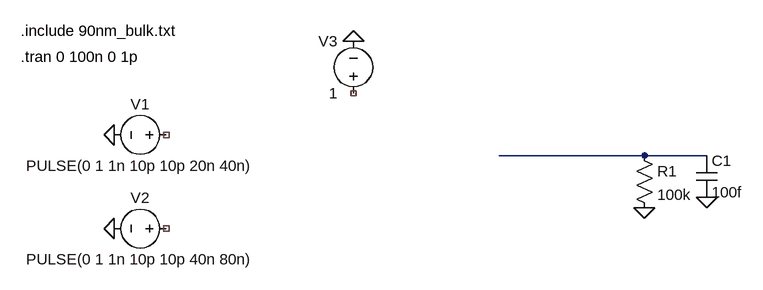
[diagram p0: schematic testingformat.asc]
testingformat.asc, the LTspice schematic file:
Version 4
SHEET 1 960 680
WIRE 800 192 576 192
WIRE 896 192 800 192
FLAG -16 160 0
FLAG -16 304 0
FLAG 352 16 0
FLAG 800 272 0
FLAG 896 256 0
SYMBOL voltage 80 160 R90
WINDOW 0 -32 56 VBottom 2
WINDOW 3 32 56 VTop 2
WINDOW 123 0 0 Left 0
WINDOW 39 0 0 Left 0
SYMATTR InstName V1
SYMATTR Value PULSE(0 1 1n 10p 10p 20n 40n)
SYMBOL voltage 80 304 R90
WINDOW 0 -32 56 VBottom 2
WINDOW 3 32 56 VTop 2
WINDOW 123 0 0 Left 0
WINDOW 39 0 0 Left 0
SYMATTR InstName V2
SYMATTR Value PULSE(0 1 1n 10p 10p 40n 80n)
SYMBOL voltage 352 112 R180
WINDOW 0 24 96 Left 2
WINDOW 3 24 16 Left 2
WINDOW 123 0 0 Left 0
WINDOW 39 0 0 Left 0
SYMATTR InstName V3
SYMATTR Value 1
SYMBOL cap 880 192 R0
SYMATTR InstName C1
SYMATTR Value 100f
SYMBOL res 784 176 R0
SYMATTR InstName R1
SYMATTR Value 100k
TEXT -160 0 Left 2 !.include 90nm_bulk.txt
TEXT -160 40 Left 2 !.tran 0 100n 0 1p

The netlist it stands for:
* testingformat.asc
V1 NC_01 0 PULSE(0 1 1n 10p 10p 20n 40n)
V2 NC_02 0 PULSE(0 1 1n 10p 10p 40n 80n)
V3 NC_03 0 1
C1 N001 0 100f
R1 N001 0 100k
.include 90nm_bulk.txt
.tran 0 100n 0 1p
.backanno
.end